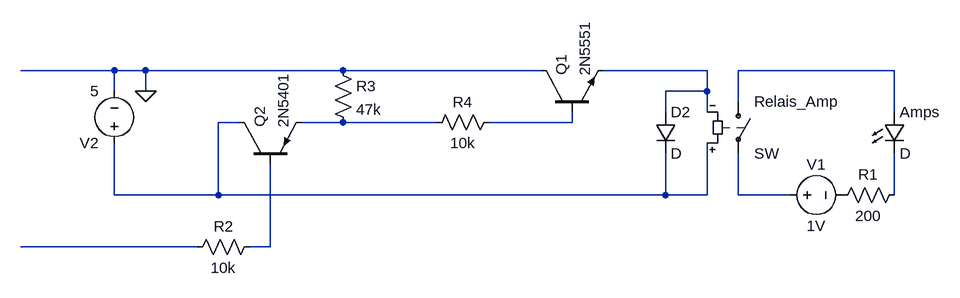
[diagram p0: schematic Standby Relai.asc]
Standby Relai.asc, the LTspice schematic file:
Version 4
SHEET 1 880 680
WIRE -976 32 -1120 32
WIRE -928 32 -976 32
WIRE -624 32 -928 32
WIRE -320 32 -624 32
WIRE -64 32 -224 32
WIRE 224 32 -16 32
WIRE -976 64 -976 32
WIRE -928 64 -928 32
WIRE -64 64 -64 32
WIRE -64 64 -128 64
WIRE -16 80 -16 32
WIRE -128 96 -128 64
WIRE -64 96 -64 64
WIRE 224 96 224 32
WIRE -784 112 -816 112
WIRE -624 112 -688 112
WIRE -480 112 -624 112
WIRE -272 112 -272 96
WIRE -272 112 -400 112
WIRE -976 224 -976 144
WIRE -816 224 -816 112
WIRE -816 224 -976 224
WIRE -128 224 -128 160
WIRE -128 224 -816 224
WIRE -64 224 -64 144
WIRE -64 224 -128 224
WIRE -16 224 -16 160
WIRE 64 224 -16 224
WIRE 224 224 224 160
WIRE -848 304 -1120 304
WIRE -736 304 -736 176
WIRE -736 304 -768 304
FLAG -928 64 0
SYMBOL sw -16 64 R0
SYMATTR InstName Relais_Amp
SYMATTR SpiceModel JQX-115F
SYMBOL LED 208 96 R0
SYMATTR InstName Amps
SYMBOL voltage 48 224 R270
WINDOW 0 32 56 VTop 2
WINDOW 3 -32 56 VBottom 2
WINDOW 123 0 0 Left 0
WINDOW 39 0 0 Left 0
SYMATTR InstName V1
SYMATTR Value 1V
SYMBOL res 240 208 R90
WINDOW 0 0 56 VBottom 2
WINDOW 3 32 56 VTop 2
SYMATTR InstName R1
SYMATTR Value 200
SYMBOL diode -144 96 R0
SYMATTR InstName D2
SYMBOL voltage -976 160 R180
WINDOW 123 0 0 Left 0
WINDOW 39 0 0 Left 0
SYMATTR InstName V2
SYMATTR Value 5
SYMBOL pnp -784 176 R270
SYMATTR InstName Q2
SYMATTR Value 2N5401
SYMBOL res -752 288 R90
WINDOW 0 0 56 VBottom 2
WINDOW 3 32 56 VTop 2
SYMATTR InstName R2
SYMATTR Value 10k
SYMBOL res -640 16 R0
SYMATTR InstName R3
SYMATTR Value 47k
SYMBOL res -384 96 R90
WINDOW 0 0 56 VBottom 2
WINDOW 3 32 56 VTop 2
SYMATTR InstName R4
SYMATTR Value 10k
SYMBOL npn -320 96 R270
SYMATTR InstName Q1
SYMATTR Value 2N5551

The netlist it stands for:
* Standby Relai.asc
S§Relais_Amp N002 N006 N003 N001 JQX-115F SW
D§Amps N002 N007 D
V1 N006 P001 1V
R1 N007 P001 200
D2 N001 N003 D
V2 N003 0 5
Q2 N003 N009 N004 0 2N5401
R2 N009 N008 10k
R3 0 N004 47k
R4 N005 N004 10k
Q1 0 N005 N001 0 2N5551
.model D D
.lib standard.dio
.model NPN NPN
.model PNP PNP
.lib standard.bjt
.backanno
.end